# Altium project Mirny.PrjPCB (part 4 of 4)

## Sheet Supply_Mirny.SchDoc: Power supply
size 420 x 297 mm; Author: K.B.; CompanyName: WUT; DrawnBy: K.B.; Organization: WUT ISE; Address1: Warsaw Univeristy of Technology; Address2: Nowowiejska 15/19; DocumentNumber: 6; Revision: 1.1.4; SheetNumber: 6; SheetTotal: 8; EDA_Number: ARTIQ; Projet: ARTIQ/SINARA; ModifiedBy: -; CreateDate: XX/XX/XXXX; CheckedDate: -; Title2: DC/DC & LDOs; DivGrp: ISE; Designer: K.B.; ModifiedDate: -; ProjectName: ARTIQ/SINARA
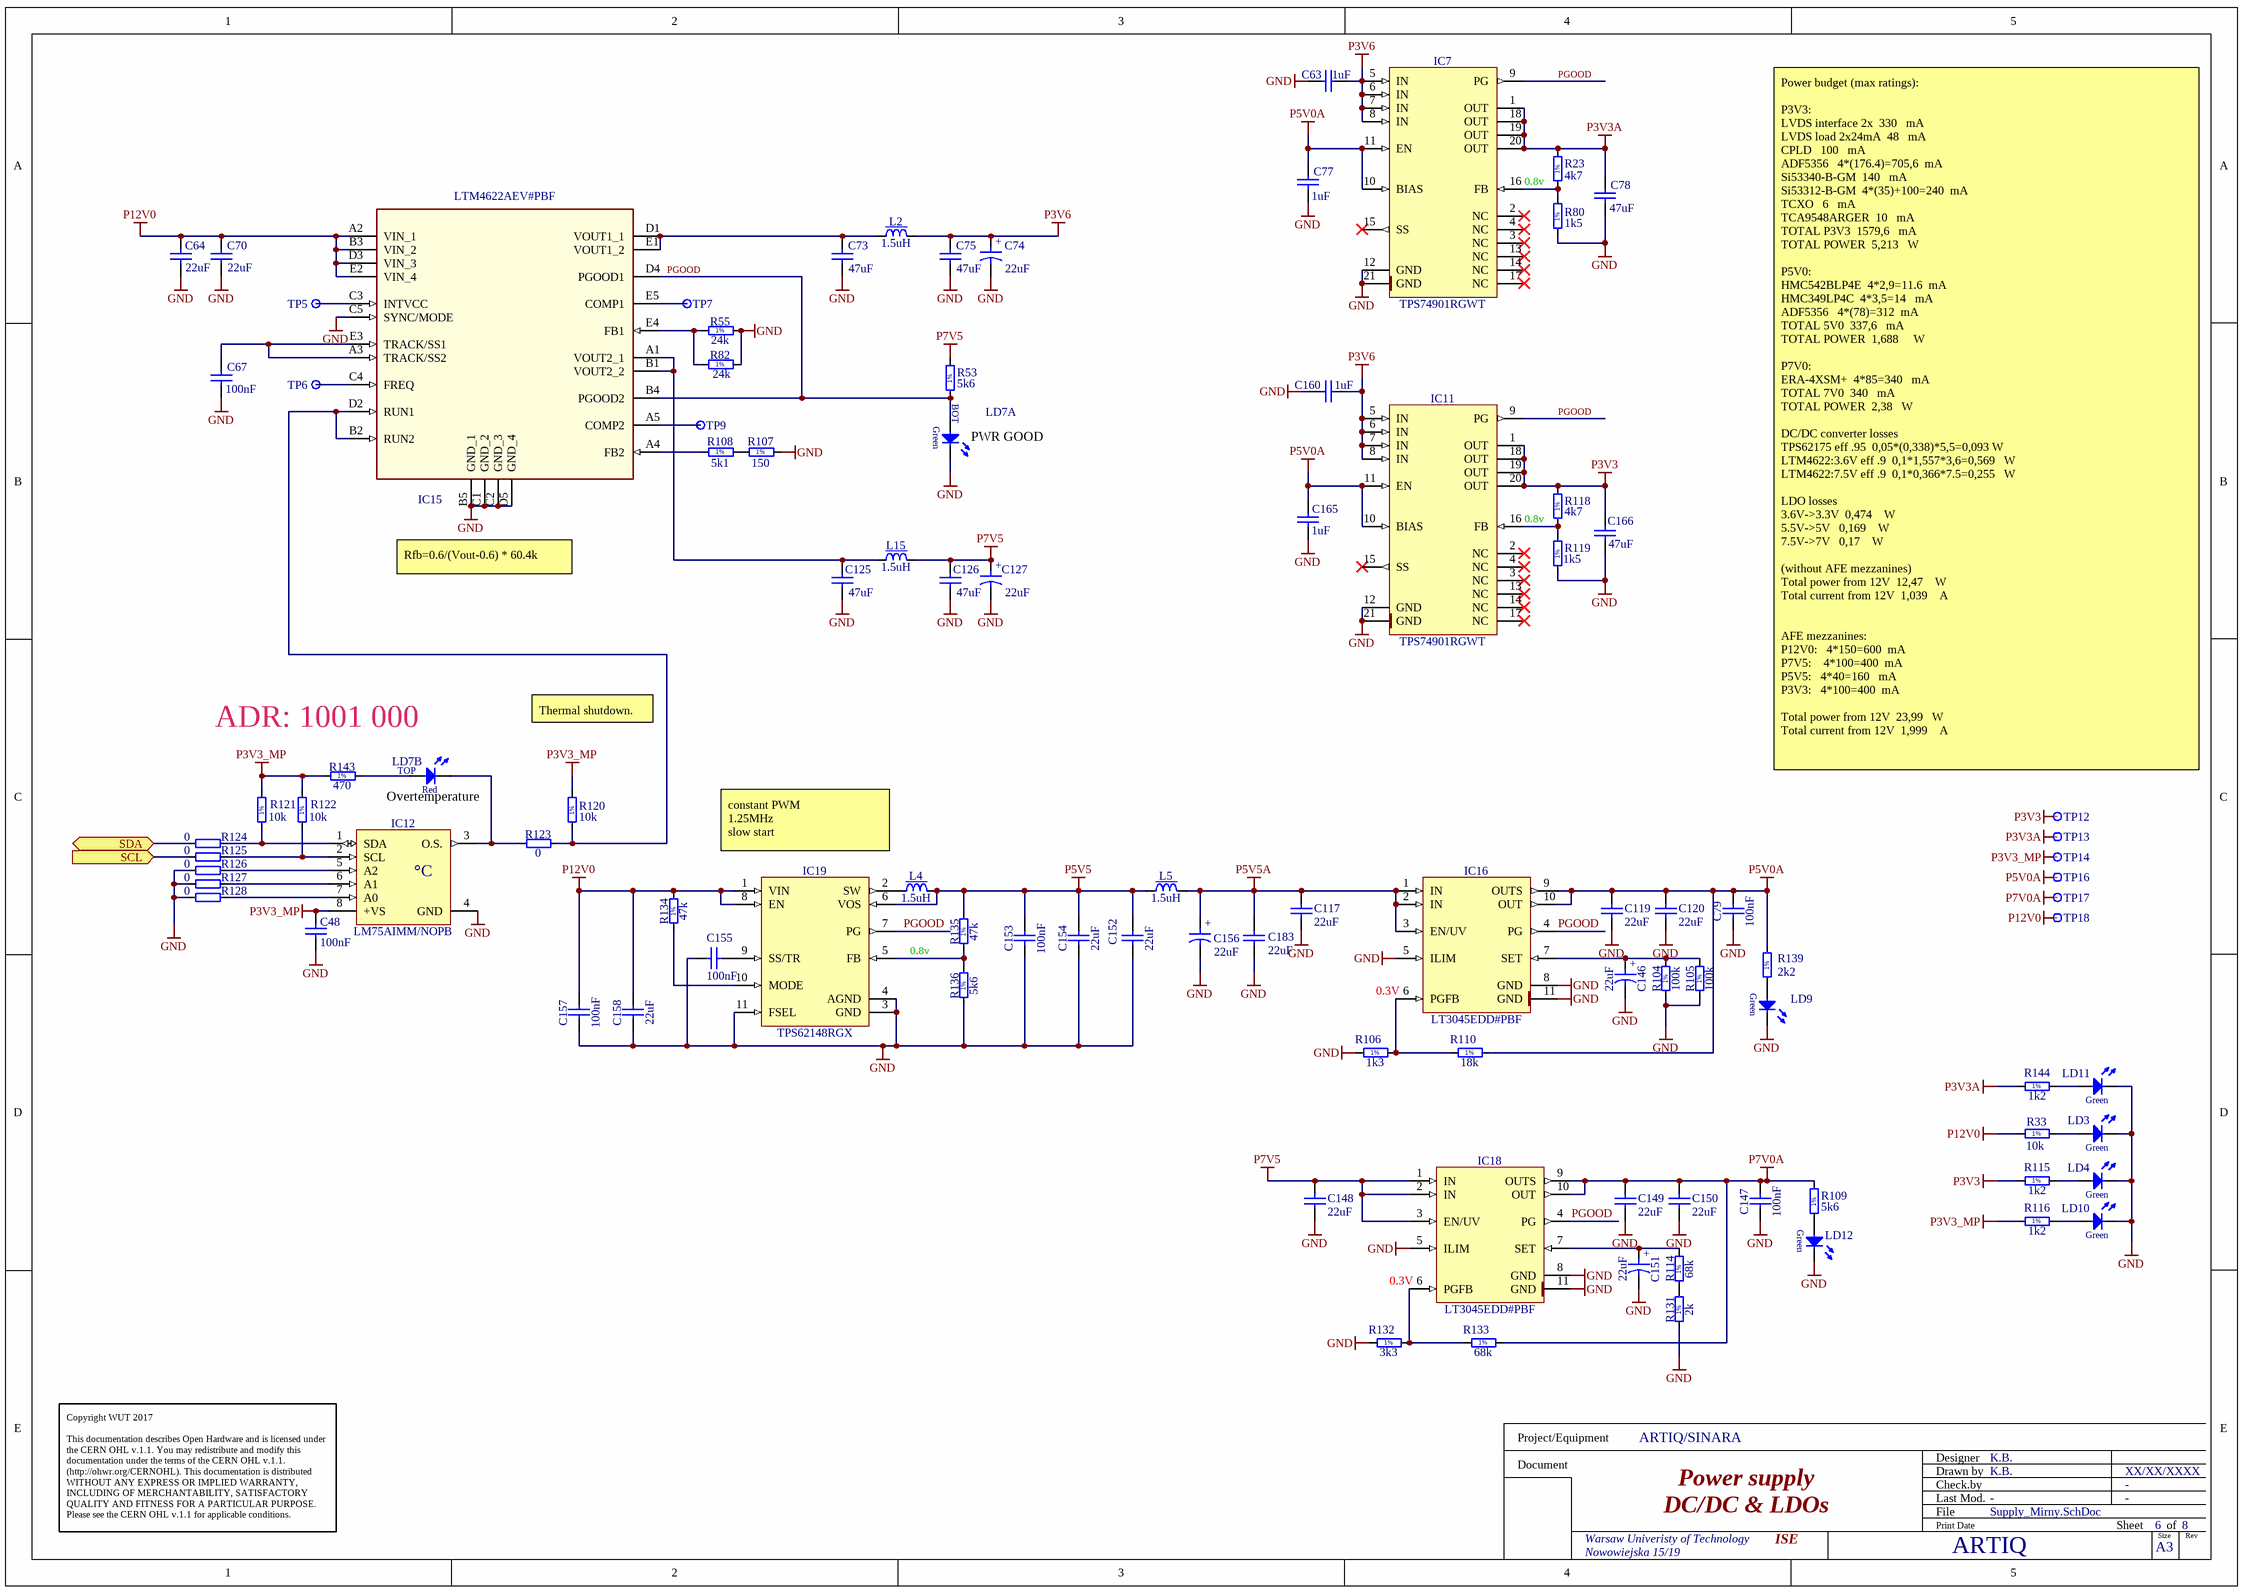
[diagram p8: Supply_Mirny.SchDoc]

### Parts
(Parts that share a designator on the sheet are numbered #1, #2 ... from top to bottom, then left to right.)
C48#2  100nF  [CAPC1005X55N]
C63  1uF  [CAPC1005X55N]
C64  22uF  [CAPC2012X135N]
C67  100nF  [CAPC1005X55N]
C70  22uF  [CAPC2012X135N]
C73  47uF  [CAPC3225X270N]
C74  22uF  [CAPMP3528X210N]
C75  47uF  [CAPC3225X270N]
C77  1uF  [CAPC1005X55N]
C78  47uF  [CAPC3225X270N]
C79  100nF  [CAPC1005X55N]
C117  22uF  [CAPC2012X135N]
C119  22uF  [CAPC2012X135N]
C120  22uF  [CAPC2012X135N]
C125  47uF  [CAPC3225X270N]
C126  47uF  [CAPC3225X270N]
C127  22uF  [CAPMP3528X210N]
C146  22uF  [CAPMP3528X210N]
C147  100nF  [CAPC1005X55N]
C148  22uF  [CAPC2012X135N]
C149  22uF  [CAPC2012X135N]
C150  22uF  [CAPC2012X135N]
C151  22uF  [CAPMP3528X210N]
C152  22uF  [CAPC2012X135N]
C153  100nF  [CAPC1005X55N]
C154  22uF  [CAPC2012X135N]
C155  100nF  [CAPC1005X55N]
C156  22uF  [CAPMP3528X210N]
C157  100nF  [CAPC1005X55N]
C158  22uF  [CAPC2012X135N]
C160  1uF  [CAPC1005X55N]
C165  1uF  [CAPC1005X55N]
C166  47uF  [CAPC3225X270N]
C183  22uF  [CAPC2012X135N]
IC7  TPS74901RGWT  [QFN65P500X500X100-21N-S325]
IC11  TPS74901RGWT  [QFN65P500X500X100-21N-S325]
IC12  LM75AIMM/NOPB  [SOP65P490X109-8N]
IC15  LTM4622AEV#PBF  [LGA25C127P5X5_625X625X190]
IC16  LT3045EDD#PBF  [SON50P300X300X80-11N-R175X248]
IC18  LT3045EDD#PBF  [SON50P300X300X80-11N-R175X248]
IC19  TPS62148RGX  [TEXAS_RGX0011A]
L2  1.5uH  [IND_TDK_SPM6530]
L4  1.5uH  [IND_TDK_SPM6530]
L5  1.5uH  [IND_TDK_SPM6530]
L15  1.5uH  [IND_TDK_SPM6530]
LD3  Green  [LED_KINGBRIGHT_KPH-1608CGCKr]  (value not drawn)
LD4  Green  [LED_KINGBRIGHT_KPH-1608CGCKr]  (value not drawn)
LD7  Red/Green  [LED_DIALIGHT_571-0112F]  (value not drawn)  (parts A,B of 2)
LD9  Green  [LED_KINGBRIGHT_KPH-1608CGCKr]  (value not drawn)
LD10  Green  [LED_KINGBRIGHT_KPH-1608CGCKr]  (value not drawn)
LD11  Green  [LED_KINGBRIGHT_KPH-1608CGCKr]  (value not drawn)
LD12  Green  [LED_KINGBRIGHT_KPH-1608CGCKr]  (value not drawn)
R23  4k7  [RESC1608X55N]
R33  10k  [RESC1005X40N]
R53  5k6  [RESC1608X55N]
R55  24k  [RESC1608X55N]
R80  1k5  [RESC1608X55N]
R82  24k  [RESC1608X55N]
R104  100k  [RESC1005X40N]
R105  100k  [RESC1005X40N]
R106  1k3  [RESC1608X55N]
R107  150  [RESC1005X40N]
R108  5k1  [RESC1608X55N]
R109  5k6  [RESC1608X55N]
R110  18k  [RESC1005X40N]
R114  68k  [RESC1005X40N]
R115  1k2  [RESC1005X40N]
R116  1k2  [RESC1005X40N]
R118  4k7  [RESC1608X55N]
R119  1k5  [RESC1608X55N]
R120  10k  [RESC1005X40N]
R121  10k  [RESC1005X40N]
R122  10k  [RESC1005X40N]
R123  0  [RESC1005X40N]
R124  0  [RESC1005X40N]
R125  0  [RESC1005X40N]
R126  0  [RESC1005X40N]
R127  0  [RESC1005X40N]
R128  0  [RESC1005X40N]
R131  2k  [RESC1005X40N]
R132  3k3  [RESC1608X55N]
R133  68k  [RESC1005X40N]
R134  47k  [RESC1005X40N]
R135  47k  [RESC1005X40N]
R136  5k6  [RESC1005X40N]
R139  2k2  [RESC1608X55N]
R143  470  [RESC1005X40N]
R144  1k2  [RESC1005X40N]
TP5  Test Point  [TPS127]  (value not drawn)
TP6  Test Point  [TPS127]  (value not drawn)
TP7  Test Point  [TPS127]  (value not drawn)
TP9  Test Point  [TPS127]  (value not drawn)
TP12  Test Point  [TPS127]  (value not drawn)  (no BOM)
TP13  Test Point  [TPS127]  (value not drawn)  (no BOM)
TP14  Test Point  [TPS127]  (value not drawn)  (no BOM)
TP16  Test Point  [TPS127]  (value not drawn)  (no BOM)
TP17  Test Point  [TPS127]  (value not drawn)  (no BOM)
TP18  Test Point  [TPS127]  (value not drawn)  (no BOM)

### Ports
SCL (in), SDA (bidir)

### Nets
GND: C48#2.1 C63.2 C64.1 C67.1 C70.1 C73.1 C74.2 C75.1 C77.1 C78.1 C79.1 C117.2 C119.2 C120.2 C125.1 C126.1 C127.2 C146.2 C147.1 C148.2 C149.2 C150.2 C151.2 C152.1 C153.1 C154.1 C155.2 C156.2 C157.1 C158.1 C160.2 C165.1 C166.1 C183.1 IC7.12(GND) IC7.21(GND) IC11.12(GND) IC11.21(GND) IC12.4(GND) IC15.B5(GND_1) IC15.C1(GND_2) IC15.C2(GND_3) IC15.C5(SYNC/MODE) IC15.D5(GND_4) IC16.5(ILIM) IC16.8(GND) IC16.11(GND) IC18.5(ILIM) IC18.8(GND) IC18.11(GND) IC19.3(GND) IC19.4(AGND) IC19.11(FSEL) LD3.1(C) LD4.1(C) LD7.1(C) LD9.1(C) LD10.1(C) LD11.1(C) LD12.1(C) R55.2 R80.1 R82.2 R104.1 R105.1 R106.1 R107.2 R119.1 R126.1 R127.1 R128.1 R131.1 R132.1 R136.1
P3V3: C166.2 IC11.1(OUT) IC11.18(OUT) IC11.19(OUT) IC11.20(OUT) R115.1 R118.2 TP12.1
P3V3_MP: C48#2.2 IC12.8(+VS) R116.1 R120.2 R121.2 R122.2 R143.1 TP14.1
P3V3A: C78.2 IC7.1(OUT) IC7.18(OUT) IC7.19(OUT) IC7.20(OUT) R23.2 R144.1 TP13.1
P3V6: C63.1 C74.1 C75.2 C160.1 IC7.5(IN) IC7.6(IN) IC7.7(IN) IC7.8(IN) IC11.5(IN) IC11.6(IN) IC11.7(IN) IC11.8(IN) L2.2
P5V0A: C77.2 C79.2 C119.1 C120.1 C165.2 IC7.10(BIAS) IC7.11(EN) IC11.10(BIAS) IC11.11(EN) IC16.9(OUTS) IC16.10(OUT) R110.2 R139.2 TP16.1
P5V5: C152.2 C153.2 C154.2 IC19.6(VOS) L4.2 L5.1 R135.2
P5V5A: C117.1 C156.1 C183.2 IC16.1(IN) IC16.2(IN) IC16.3(EN/UV) L5.2
P7V0A: C147.2 C149.1 C150.1 IC18.9(OUTS) IC18.10(OUT) R109.2 R133.2 TP17.1
P7V5: C126.2 C127.1 C148.1 IC18.1(IN) IC18.2(IN) IC18.3(EN/UV) L15.2 R53.2
P12V0: C64.2 C70.2 C157.2 C158.2 IC15.A2(VIN_1) IC15.B3(VIN_2) IC15.D3(VIN_3) IC15.E2(VIN_4) IC19.1(VIN) IC19.8(EN) R33.1 R134.2 TP18.1
PGOOD: IC7.9(PG) IC11.9(PG) IC15.B4(PGOOD2) IC15.D4(PGOOD1) IC16.4(PG) IC18.4(PG) IC19.7(PG) LD7.2(A) R53.1
NetC67_2: C67.2 IC15.A3(TRACK/SS2) IC15.E3(TRACK/SS1)
NetC73_2: C73.2 IC15.D1(VOUT1_1) IC15.E1(VOUT1_2) L2.1
NetC125_2: C125.2 IC15.A1(VOUT2_1) IC15.B1(VOUT2_2) L15.1
NetC146_1: C146.1 IC16.7(SET) R104.2 R105.2
NetC151_1: C151.1 IC18.7(SET) R114.2
NetC155_1: C155.1 IC19.9(SS/TR)
NetIC7_16: IC7.16(FB) R23.1 R80.2
NetIC11_16: IC11.16(FB) R118.1 R119.2
NetIC12_1: IC12.1(SDA) R121.1 R124.2
NetIC12_2: IC12.2(SCL) R122.1 R125.2
NetIC12_3: IC12.3(O.S.) LD7.3(C) R123.1
NetIC12_5: IC12.5(A2) R126.2
NetIC12_6: IC12.6(A1) R127.2
NetIC12_7: IC12.7(A0) R128.2
NetIC15_A4: IC15.A4(FB2) R108.1
NetIC15_A5: IC15.A5(COMP2) TP9.1
NetIC15_B2: IC15.B2(RUN2) IC15.D2(RUN1) R120.1 R123.2
NetIC15_C3: IC15.C3(INTVCC) TP5.1
NetIC15_C4: IC15.C4(FREQ) TP6.1
NetIC15_E4: IC15.E4(FB1) R55.1 R82.1
NetIC15_E5: IC15.E5(COMP1) TP7.1
NetIC16_6: IC16.6(PGFB) R106.2 R110.1
NetIC18_6: IC18.6(PGFB) R132.2 R133.1
NetIC19_2: IC19.2(SW) L4.1
NetIC19_5: IC19.5(FB) R135.1 R136.2
NetIC19_10: IC19.10(MODE) R134.1
NetLD3_2: LD3.2(A) R33.2
NetLD4_2: LD4.2(A) R115.2
NetLD7_4: LD7.4(A) R143.2
NetLD9_2: LD9.2(A) R139.1
NetLD10_2: LD10.2(A) R116.2
NetLD11_2: LD11.2(A) R144.2
NetLD12_2: LD12.2(A) R109.1
NetR107_1: R107.1 R108.2
NetR114_1: R114.1 R131.2
NetR124_1: R124.1 ; port SDA
NetR125_1: R125.1 ; port SCL

Not connected (* = marked no-connect by the designer): IC7 2(NC)* 3(NC)* 4(NC)* 13(NC)* 14(NC)* 15(SS)* 17(NC)*; IC11 2(NC)* 3(NC)* 4(NC)* 13(NC)* 14(NC)* 15(SS)* 17(NC)*

### Notes on the sheet
- 0.8v
- (near LD7) PWR GOOD
- Rfb=0.6/(Vout-0.6) * 60.4k
- ADR: 1001 000
- Thermal shutdown.
- (near LD7) Overtemperature
- Power budget (max ratings):
  P3V3:
  LVDS interface 2x		330			mA
  LVDS load 2x24mA		48			mA
  CPLD			100			mA
  ADF5356			4*(176.4)=705,6		mA
  Si53340-B-GM		140			mA
  Si53312-B-GM		4*(35)+100=240		mA
  TCXO			6			mA
  TCA9548ARGER		10			mA
  TOTAL P3V3		1579,6			mA
  TOTAL POWER		5,213			W
  P5V0:
  HMC542BLP4E		4*2,9=11.6		mA
  HMC349LP4C		4*3,5=14			mA
  ADF5356			4*(78)=312		mA
  TOTAL 5V0		337,6			mA
  TOTAL POWER		1,688 	 		W
  P7V0:
  ERA-4XSM+		4*85=340			mA
  TOTAL 7V0		340			mA
  TOTAL POWER		2,38			W
  DC/DC converter losses
  TPS62175 eff .95		0,05*(0,338)*5,5=0,093	W
  LTM4622:3.6V eff .9		0,1*1,557*3,6=0,569 		W
  LTM4622:7.5V eff .9		0,1*0,366*7.5=0,255 		W
  LDO losses
  3.6V->3.3V		0,474 			W
  5.5V->5V			0,169 			W
  7.5V->7V			0,17 			W
  (without AFE mezzanines)
  Total power from 12V 	12,47 			W
  Total current from 12V 	1,039			 A
  AFE mezzanines:
  P12V0:			4*150=600		mA
  P7V5: 			4*100=400		mA
  P5V5:			4*40=160			mA
  P3V3:			4*100=400		mA
  Total power from 12V 	23,99			W
  Total current from 12V 	1,999 			A
- constant PWM
  1.25MHz
  slow start
- (near IC16) 0.3V
- (near IC18) 0.3V
- Copyright WUT 2017
  This documentation describes Open Hardware and is licensed under the CERN OHL v.1.1. You may redistribute and modify this documentation under the terms of the CERN OHL v.1.1. (http://ohwr.org/CERNOHL). This documentation is distributed WITHOUT ANY EXPRESS OR IMPLIED WARRANTY, INCLUDING OF MERCHANTABILITY, SATISFACTORY QUALITY AND FITNESS FOR A PARTICULAR PURPOSE. Please see the CERN OHL v.1.1 for applicable conditions.
- Project/Equipment
- Document
- Designer
- Drawn by
- Check.by
- File
- Last Mod.
- Print Date
- Sheet
- Size
- A3
- of
- Rev
- (in symbol CTE3528-21_22UF_10V_10%_LESR0700) +
- (in symbol LED_DIALIGHT_571-0112F, part A) BOT; Green
- (in symbol LED_DIALIGHT_571-0112F, part B) TOP; Red
- (in symbol LM75AIMM/NOPB) °C
- (in symbol R0402_2K_1%_0.0625W_100PPM) 1%
- (in symbol R0402_5K6_1%_0.0625W_100PPM) 1%
- (in symbol R0402_10K_1%_0.0625W_100PPM) 1%
- (in symbol R0402_18K_1%_0.0625W_100PPM) 1%
- (in symbol R0402_47K_1%_0.0625W_100PPM) 1%
- (in symbol R0402_49R9_1%_0.0625W_100PPM) 1%
- (in symbol R0402_68K_1%_0.0625W_100PPM) 1%
- (in symbol R0402_100K_1%_0.0625W_100PPM) 1%
- (in symbol R0402_150R_1%_0.0625W_100PPM) 1%
- (in symbol R0402_470R_1%_0.0625W_100PPM) 1%
- (in symbol R0603_1K3_1%_0.1W_100PPM) 1%
- (in symbol R0603_1K5_1%_0.1W_100PPM) 1%
- (in symbol R0603_2K2_1%_0.1W_100PPM) 1%
- (in symbol R0603_3K3_1%_0.1W_100PPM) 1%
- (in symbol R0603_4K7_1%_0.1W_100PPM) 1%
- (in symbol R0603_5k1_1%_0.1W_100PPM) 1%
- (in symbol R0603_5K6_1%_0.1W_100PPM) 1%
- (in symbol R0603_24K_1%_0.1W_100PPM) 1%

### Library data of the parts
C48#2 C67 C79 C147 C153 C155 C157 = CC0402_100NF_16V_10%_X5R: Non-polarised capacitor; Part Description: SMD Multilayer Chip Ceramic Capacitor; Manufacturer: GENERIC; Manufacturer1 Part Number: GRM155R61C104KA88D; Voltage: 16V; TC: X5R; Tolerance: ±10%; Part Number: CC0402_100NF_16V_10%_X5R; Component Kind: Standard; Component Type: Standard; Pin Count: 2; Value: 100nF; Status: None; Manufacturer Part Number: CC0402_100NF_16V_10%_X5R; Case: 0402; Mounted: Yes; Socket: No; SMD: Yes; Sense: No; Manufacturer1 Example: MURATA; Manufacturer1 ComponentHeight: 0.55mm; HelpURL: \\cern.ch\dfs\Applications\Altium\Datasheets\CC0402_X5R_MURATA_GRM.pdf; Author: CERN DEM JLC; CreateDate: 10.12.2013; LatestRevisionDate: 10.12.2013
C63 C77 C160 C165 = CC0402_1UF_16V_10%_X5R: Non-polarised capacitor; Part Description: SMD Multilayer Chip Ceramic Capacitor; Manufacturer: GENERIC; Manufacturer1 Part Number: C1005X5R1C105KT; Voltage: 16V; TC: X5R; Tolerance: ±10%; Part Number: CC0402_1UF_16V_10%_X5R; Component Kind: Standard; Component Type: Standard; Pin Count: 2; Value: 1uF; Status: Preferred; Manufacturer Part Number: CC0402_1UF_16V_10%_X5R; Case: 0402; Mounted: Yes; Socket: No; SMD: Yes; Sense: No; Manufacturer1 Example: TDK; Manufacturer1 ComponentHeight: 0.55mm; HelpURL: \\cern.ch\dfs\Applications\Altium\Datasheets\CC0402_X5R_TDK_C.pdf; Author: CERN DEM JLC; CreateDate: 2012-10-25; LatestRevisionDate: 2012-10-25
C64 C70 C117 C119 C120 C148-C150 C152 C154 C158 C183 = CC0805_22UF_16V_10%_X5R: Non-polarised capacitor; Part Description: SMD Multilayer Chip Ceramic Capacitor; Manufacturer: GENERIC; Manufacturer1 Part Number: C2012X5R1C226KT; Voltage: 16V; TC: X5R; Tolerance: ±10%; Part Number: CC0805_22UF_16V_10%_X5R; Component Kind: Standard; Component Type: Standard; Pin Count: 2; Value: 22uF; Status: Preferred; Manufacturer Part Number: CC0805_22UF_16V_10%_X5R; Case: 0805; Mounted: Yes; Socket: No; SMD: Yes; Sense: No; Manufacturer1 Example: TDK; Manufacturer1 ComponentHeight: 1.35mm; HelpURL: \\cern.ch\dfs\Applications\Altium\Datasheets\CC0805_X5R_TDK_C.pdf; Author: CERN DEM JLC; CreateDate: 25.10.2012; LatestRevisionDate: 25.10.2012
C73 C75 C78 C125 C126 C166 = CC1210_47UF_10V_20%_X5R: Non-polarised capacitor; Part Description: SMD Multilayer Chip Ceramic Capacitor; Manufacturer: GENERIC; Manufacturer1 Part Number: LMK325BJ476MM-T; Voltage: 10V; TC: X5R; Tolerance: ±20%; Part Number: CC1210_47UF_10V_20%_X5R; Component Kind: Standard; Component Type: Standard; Pin Count: 2; Value: 47uF; Status: None; Manufacturer Part Number: CC1210_47UF_10V_20%_X5R; Case: 1210; Mounted: Yes; Socket: No; SMD: Yes; Sense: No; Manufacturer1 Example: TAIYO YUDEN; Manufacturer1 ComponentHeight: 2.7mm; HelpURL: \\cern.ch\dfs\Applications\Altium\Datasheets\CC1210_X5R_TAIYO-YUDEN_HIGH-VALUE.pdf; Author: CERN DEM JLC; CreateDate: 04.05.2011; LatestRevisionDate: 04.05.2011
C74 C127 C146 C151 C156 = CTE3528-21_22UF_10V_10%_LESR0700: Polarised capacitor; Part Description: Low ESR 0R7 Solid Tantalum Chip Capacitor; Manufacturer: GENERIC; Manufacturer1 Part Number: TPSB226K010R0700; Voltage: 10V; Tolerance: ±10%; Part Number: CTE3528-21_22UF_10V_10%_LESR0700; Component Kind: Standard; Component Type: Standard; Pin Count: 2; Value: 22uF; Status: Preferred; Manufacturer Part Number: CTE3528-21_22UF_10V_10%_LESR0700; Case: B; Mounted: Yes; Socket: No; SMD: Yes; Sense: No; Manufacturer1 Example: AVX; Manufacturer1 ComponentHeight: 2.1mm; HelpURL: \\cern.ch\dfs\Applications\Altium\Datasheets\CTE-LESR_AVX_TPS.pdf; Author: CERN DEM JLC; CreateDate: 05.05.2008; LatestRevisionDate: 20.01.2009
IC7 IC11 = TPS74901RGWT: 3A, 0.8 to 3.6V Adjustable Low-Dropout Linear Regulator with Programmable Soft-Start; Part Description: 0.8V to 3.6V, 3.0A Low Dropout Linear Regulator with Programmable Soft-Start; Manufacturer: TEXAS INSTRUMENTS; PressFit: No; Bonding: No; Part Number: TPS74901RGWT; Component Kind: Standard; Component Type: Standard; Device: TPS74901RGWT; PackageDescription: QFN, 0.65mm pitch,square; 20 pin, 5mm X 5mm X 1mm H body (w/thermal tab 3.25 X 3.25mm),  IPC Medium Density; Manufacturer Part Number: TPS74901RGWT; Pin Count: 21; Case: QFN20; Mounted: Yes; Socket: No; SMD: Yes; Sense: No; ComponentHeight: 1mm; HelpURL: \\cern.ch\dfs\Applications\Altium\Datasheets\TPS74901RGWT.pdf; Author: CERN DEM JLC; CreateDate: 07.03.2013; LatestRevisionDate: 07.03.2013
IC12 = LM75AIMM/NOPB: Digital Temperature Sensor and Thermal Watchdog with Two-Wire Interface; Part Description: -25° to +100°C ±2°C Digital Temperature Sensor and Thermal Watchdog with Two-Wire Interface; Manufacturer: TEXAS INSTRUMENTS; PressFit: No; Bonding: No; Part Number: LM75AIMM/NOPB; Component Kind: Standard; Component Type: Standard; Device: LM75AIMM/NOPB; PackageDescription: SOP, 0.65mm pitch; 8 pin,3.00mm W X 3.00mm L X 1.09mm H bodyI, PC Medium Density; Manufacturer Part Number: LM75AIMM/NOPB; Pin Count: 8; Case: SSOP8; Mounted: Yes; Socket: No; SMD: Yes; Sense: No; ComponentHeight: 1.09mm; HelpURL: \\cern.ch\dfs\Applications\Altium\Datasheets\LM75AIMM-NOPB.pdf; Author: CERN DEM JLC; CreateDate: 15.10.2012; LatestRevisionDate: 15.10.2012
IC15 = PM_LTM4622: Dual Ultrathin 2A or Single 4A, 3.6V to 20V, 1.5V to 12V   Step-Down DC/DC μModule Regulator; Manufacturer: LINEAR TECHNOLOGY; PressFit: No; Bonding: No; Part Number: LTM4622AEV#PBF; Component Kind: Standard; Component Type: Standard; Device: LTM4622AEV#PBF; PackageDescription: LGA, 25-Leads, Body 6.25x6.25mmx1.90mm, Pitch 1.27mm; Part Description: Dual Ultrathin 2A or Single 4A, 3.6V to 20V, 1.5V to 12V   Step-Down DC/DC μModule Regulator; Manufacturer Part Number: LTM4622AEV#PBF; Pin Count: 25; Case: LGA25; Mounted: Yes; Socket: No; SMD: Yes; Sense: No; ComponentHeight: 2.92mm; HelpURL: \\cern.ch\dfs\Applications\Altium\Datasheets\LTM4619EV#PBF.pdf; Author: GK; CreateDate: 06.05.2010; LatestRevisionDate: 07.12.2011
IC16 IC18 = LT3045EDD#PBF: 20V, 500mA, Ultralow Noise, Ultrahigh PSRR Linear Regulator; Manufacturer: LINEAR TECHNOLOGY; PressFit: No; Bonding: No; Part Number: LT3045EDD#PBF; Component Kind: Standard; Component Type: Standard; Device: LT3045EDD#PBF; PackageDescription: SON, 0.50mm Pitch, 10-pin, 3.00mm W  X 3.00mm L X 0.80mm Height, (w/thermal tab 1.75 X 2.48 mm), IPC Medium Density; Part Description: 20V, 500mA, Ultralow Noise, Ultrahigh PSRR Linear Regulator; Manufacturer Part Number: LT3045EDD#PBF; Pin Count: 11; Case: SON10; Mounted: Yes; Socket: No; SMD: Yes; Sense: No; ComponentHeight: 0.8mm; HelpURL: \\cern.ch\dfs\Applications\Altium\Datasheets\LT3045EDD#PBF.pdf; Author: CERN DEM JLC; CreateDate: 07.12.2016; LatestRevisionDate: 07.12.2016
IC19 = TPS62148RGX: 3V-17V 2A Step-Down Converter, High Accuracy, With DCS-Control; Manufacturer: TEXAS INSTRUMENTS; PressFit: No; Bonding: No; Part Number: TPS62148RGX; Component Kind: Standard; Component Type: Standard; Device: TPS62148RGX; PackageDescription: TEXAS Case Style (R-VQFN-HR-N11), 0.50mm Pitch, 11-pin, 2.00mm W X 3.00mm L X 1.00mm H Body; Part Description: 3V-17V 2A Step-Down Converter, High Accuracy, With DCS-Control; Manufacturer Part Number: TPS62148RGX; Pin Count: 11; Case: QFN14; Mounted: Yes; Socket: No; SMD: Yes; Sense: No; ComponentHeight: 1mm; HelpURL: \\cern.ch\dfs\Applications\Altium\Datasheets\TPS62148RGX.pdf; Author: CERN DEM MR; CreateDate: 08.02.2019; LatestRevisionDate: 08.02.2019
L2 L4 L5 L15 = IND_1.5UH_20%_TDK_SPM6530: Inductor With Core; Part Description: SMD Inductor for Power Circuits (Wound Metal), SPM Series; Manufacturer: TDK; Manufacturer Part Number: SPM6530T-1R5M100; Power: 11A; Resistance: 0.0097R; Tolerance: ±20%; Part Number: IND_1.5UH_20%_TDK_SPM6530; Component Kind: Standard; Component Type: Standard; Pin Count: 2; Value: 1.5uH; Status: None; Mounted: Yes; Socket: No; SMD: Yes; Sense: No; ComponentHeight: 3mm; HelpURL: \\cern.ch\dfs\Applications\Altium\Datasheets\IND_TDK_SPM6530.pdf; Author: CERN DEM MR; CreateDate: 08.11.2016; LatestRevisionDate: 08.11.2016
LD3 LD4 LD9-LD12 = LED_0603_Green: Green 0603; Part Number: LED_KINGBRIGHT_KPH-1608CGCK; Part Description: SMD Green LED, Case 1.6mmX0.8mm(0603), 0.65mm Thickness; Manufacturer: KINGBRIGHT; Manufacturer Part Number: KPH-1608CGCK; PressFit: No; Bonding: No; Component Kind: Standard; Component Type: Standard; Color: Green; Footprint: LED_KINGBRIGHT_KPH-1608CGCK; PackageDescription: SMT Green LED, Case 0603, Body L 1.6 x W 0.8mm H 0.65mm; Pin Count: 2; Mounted: Yes; Socket: No; SMD: Yes; Sense: No; ComponentHeight: 0.65mm; HelpURL: \\cern.ch\dfs\Applications\Altium\Datasheets\LED_KINGBRIGHT_KPH-1608CGCK.pdf; Author: CERN DEM JLC; CreateDate: 03.07.2017; LatestRevisionDate: 03.07.2017
LD7 = LED_DIALIGHT_571-0112F: 2x LED  Botom Green, Top Red; Part Description: Dual 2mm  LEDs, Red Top,Green Bot, CBI® Circuit Board Indicator (Without positioning pins); PressFit: No; Bonding: No; Part Number: LED_DIALIGHT_571-0112F; Component Kind: Standard; Component Type: Standard; Color: Red/Green; PackageDescription: 2x 2mm LED (Top: Red, Bot: Green) PCB Edge Mounting (Without positioning pins) DIALIGHT 571 Serie; Manufacturer: DIALIGHT; Manufacturer Part Number: 571-0112F; Pin Count: 4; Mounted: Yes; Socket: No; SMD: No; Sense: No; ComponentHeight: 8.6mm; HelpURL: \\cern.ch\dfs\Applications\Altium\Datasheets\LED_DIALIGHT_571-0112F.pdf; Author: CERN DEM JLC; CreateDate: 09.11.2009; LatestRevisionDate: 17.03.2010
R23 R118 = R0603_4K7_1%_0.1W_100PPM: Resistor - 1%; Part Description: General Purpose Thick Film Chip Resistor; Manufacturer: GENERIC; Manufacturer1 Part Number: NRC06F4701TRF; Power: 0.1W; TC: ±100ppm/°C; PressFit: No; Part Number: R0603_4K7_1%_0.1W_100PPM; Component Kind: Standard; Component Type: Standard; Pin Count: 2; Value: 4k7; Status: Preferred; Tolerance: ±1%; Manufacturer Part Number: R0603_4K7_1%_0.1W_100PPM; Case: 0603; Mounted: Yes; Sense: No; Socket: No; SMD: Yes; Manufacturer1 Example: NIC COMPONENT; Manufacturer1 ComponentHeight: 0.55mm; HelpURL: \\cern.ch\dfs\Applications\Altium\Datasheets\R0603_NIC_NRC.pdf; Author: CERN DEM JLC; CreateDate: 03.12.2007; LatestRevisionDate: 13.03.2008
R33 = R0402_10K_1%_0.0625W_100PPM: Resistor - 1%; Part Description: General Purpose Thick Film Chip Resistor; Manufacturer: GENERIC; Manufacturer1 Part Number: 232270671003L; TC: ±100ppm/°C; Part Number: R0402_10K_1%_0.0625W_100PPM; Component Kind: Standard; Component Type: Standard; Pin Count: 2; Value: 10k; Status: Not recommended; Power: 0.0625W; Tolerance: ±1%; Manufacturer Part Number: R0402_10K_1%_0.0625W_100PPM; Case: 0402; Mounted: Yes; Sense: No; Socket: No; SMD: Yes; Manufacturer1 Example: YAGEO PHYCOMP; Manufacturer1 ComponentHeight: 0.4mm; HelpURL: \\cern.ch\dfs\Applications\Altium\Datasheets\R0402_Phycomp_RC0402.pdf; Author: CERN DEM JLC; CreateDate: 03.12.2007; LatestRevisionDate: 17.10.2012
R53 R109 = R0603_5K6_1%_0.1W_100PPM: Resistor - 1%; Part Description: General Purpose Thick Film Chip Resistor; Manufacturer: GENERIC; Manufacturer1 Part Number: NRC06F5601TRF; Power: 0.1W; TC: ±100ppm/°C; Part Number: R0603_5K6_1%_0.1W_100PPM; Component Kind: Standard; Component Type: Standard; Pin Count: 2; Value: 5k6; Status: Preferred; Tolerance: ±1%; Manufacturer Part Number: R0603_5K6_1%_0.1W_100PPM; Case: 0603; Mounted: Yes; Sense: No; Socket: No; SMD: Yes; Manufacturer1 Example: NIC COMPONENT; Manufacturer1 ComponentHeight: 0.55mm; HelpURL: \\cern.ch\dfs\Applications\Altium\Datasheets\R0603_NIC_NRC.pdf; Author: CERN DEM JLC; CreateDate: 03.12.2007; LatestRevisionDate: 13.03.2008
R55 R82 = R0603_24K_1%_0.1W_100PPM: Resistor - 1%; Part Description: General Purpose Thick Film Chip Resistor; Manufacturer: GENERIC; Manufacturer1 Part Number: NRC06F2402TRF; Power: 0.1W; TC: ±100ppm/°C; PressFit: No; Part Number: R0603_24K_1%_0.1W_100PPM; Component Kind: Standard; Component Type: Standard; Pin Count: 2; Value: 24k; Status: Preferred; Tolerance: ±1%; Manufacturer Part Number: R0603_24K_1%_0.1W_100PPM; Case: 0603; Mounted: Yes; Sense: No; Socket: No; SMD: Yes; Manufacturer1 Example: NIC COMPONENT; Manufacturer1 ComponentHeight: 0.55mm; HelpURL: \\cern.ch\dfs\Applications\Altium\Datasheets\R0603_NIC_NRC.pdf; Author: CERN DEM JLC; CreateDate: 03.12.2007; LatestRevisionDate: 13.03.2008
R80 R119 = R0603_1K5_1%_0.1W_100PPM: Resistor - 1%; Part Description: General Purpose Thick Film Chip Resistor; Manufacturer: GENERIC; Manufacturer1 Part Number: NRC06F1501TRF; Power: 0.1W; TC: ±100ppm/°C; PressFit: No; Part Number: R0603_1K5_1%_0.1W_100PPM; Component Kind: Standard; Component Type: Standard; Pin Count: 2; Value: 1k5; Status: Preferred; Tolerance: ±1%; Manufacturer Part Number: R0603_1K5_1%_0.1W_100PPM; Case: 0603; Mounted: Yes; Sense: No; Socket: No; SMD: Yes; Manufacturer1 Example: NIC COMPONENT; Manufacturer1 ComponentHeight: 0.55mm; HelpURL: \\cern.ch\dfs\Applications\Altium\Datasheets\R0603_NIC_NRC.pdf; Author: CERN DEM JLC; CreateDate: 03.12.2007; LatestRevisionDate: 13.03.2008
R104 R105 = R0402_100K_1%_0.0625W_100PPM: Resistor - 1%; Part Description: General Purpose Thick Film Chip Resistor; Manufacturer: GENERIC; Manufacturer1 Part Number: 232270671004L; TC: ±100ppm/°C; PressFit: No; Part Number: R0402_100K_1%_0.0625W_100PPM; Component Kind: Standard; Component Type: Standard; Pin Count: 2; Value: 100k; Status: Not Recommended; Power: 0.0625W; Tolerance: ±1%; Manufacturer Part Number: R0402_100K_1%_0.0625W_100PPM; Case: 0402; Mounted: Yes; Sense: No; Socket: No; SMD: Yes; Manufacturer1 Example: YAGEO PHYCOMP; Manufacturer1 ComponentHeight: 0.4mm; HelpURL: \\cern.ch\dfs\Applications\Altium\Datasheets\R0402_Phycomp_RC0402.pdf; Author: CERN DEM JLC; CreateDate: 03.12.2007; LatestRevisionDate: 17.10.2012
R106 = R0603_1K3_1%_0.1W_100PPM: Resistor - 1%; Part Description: General Purpose Thick Film Chip Resistor; Manufacturer: GENERIC; Manufacturer1 Part Number: NRC06F1301TRF; Power: 0.1W; TC: ±100ppm/°C; PressFit: No; Part Number: R0603_1K3_1%_0.1W_100PPM; Component Kind: Standard; Component Type: Standard; Pin Count: 2; Value: 1k3; Status: Preferred; Tolerance: ±1%; Manufacturer Part Number: R0603_1K3_1%_0.1W_100PPM; Case: 0603; Mounted: Yes; Sense: No; Socket: No; SMD: Yes; Manufacturer1 Example: NIC COMPONENT; Manufacturer1 ComponentHeight: 0.55mm; HelpURL: \\cern.ch\dfs\Applications\Altium\Datasheets\R0603_NIC_NRC.pdf; Author: CERN DEM JLC; CreateDate: 03.12.2007; LatestRevisionDate: 13.03.2008
R107 = R0402_150R_1%_0.0625W_100PPM: Resistor - 1%; Part Description: General Purpose Thick Film Chip Resistor; Manufacturer: GENERIC; Manufacturer1 Part Number: 232270671501L; TC: ±100ppm/°C; PressFit: No; Part Number: R0402_150R_1%_0.0625W_100PPM; Component Kind: Standard; Component Type: Standard; Pin Count: 2; Value: 150; Status: Not Recommended; Power: 0.0625W; Tolerance: ±1%; Manufacturer Part Number: R0402_150R_1%_0.0625W_100PPM; Case: 0402; Mounted: Yes; Sense: No; Socket: No; SMD: Yes; Manufacturer1 Example: YAGEO PHYCOMP; Manufacturer1 ComponentHeight: 0.4mm; HelpURL: \\cern.ch\dfs\Applications\Altium\Datasheets\R0402_Phycomp_RC0402.pdf; Author: CERN DEM JLC; CreateDate: 03.12.2007; LatestRevisionDate: 17.10.2012
R108 = R0603_5k1_1%_0.1W_100PPM: Resistor - 1%; Part Description: General Purpose Thick Film Chip Resistor; Manufacturer: GENERIC; Manufacturer1 Part Number: NRC06F5101TRF; Power: 0.1W; TC: ±100ppm/°C; PressFit: No; Part Number: R0603_5K1_1%_0.1W_100PPM; Component Kind: Standard; Component Type: Standard; Pin Count: 2; Value: 5k1; Status: Preferred; Tolerance: ±1%; Manufacturer Part Number: R0603_5K1_1%_0.1W_100PPM; Case: 0603; Mounted: Yes; Sense: No; Socket: No; SMD: Yes; Manufacturer1 Example: NIC COMPONENT; Manufacturer1 ComponentHeight: 0.55mm; HelpURL: \\cern.ch\dfs\Applications\Altium\Datasheets\R0603_NIC_NRC.pdf; Author: CERN DEM JLC; CreateDate: 03.12.2007; LatestRevisionDate: 13.03.2008
R110 = R0402_18K_1%_0.0625W_100PPM: Resistor - 1%; Part Description: General Purpose Thick Film Chip Resistor; Manufacturer: GENERIC; Manufacturer1 Part Number: 232270671803L; TC: ±100ppm/°C; PressFit: No; Part Number: R0402_18K_1%_0.0625W_100PPM; Component Kind: Standard; Component Type: Standard; Pin Count: 2; Value: 18k; Status: Not Recommended; Power: 0.0625W; Tolerance: ±1%; Manufacturer Part Number: R0402_18K_1%_0.0625W_100PPM; Case: 0402; Mounted: Yes; Sense: No; Socket: No; SMD: Yes; Manufacturer1 Example: YAGEO PHYCOMP; Manufacturer1 ComponentHeight: 0.4mm; HelpURL: \\cern.ch\dfs\Applications\Altium\Datasheets\R0402_Phycomp_RC0402.pdf; Author: CERN DEM JLC; CreateDate: 03.12.2007; LatestRevisionDate: 17.10.2012
R114 R133 = R0402_68K_1%_0.0625W_100PPM: Resistor - 1%; Part Description: General Purpose Thick Film Chip Resistor; Manufacturer: GENERIC; Manufacturer1 Part Number: 232270676803L; TC: ±100ppm/°C; PressFit: No; Part Number: R0402_68K_1%_0.0625W_100PPM; Component Kind: Standard; Component Type: Standard; Pin Count: 2; Value: 68k; Status: Not Recommended; Power: 0.0625W; Tolerance: ±1%; Manufacturer Part Number: R0402_68K_1%_0.0625W_100PPM; Case: 0402; Mounted: Yes; Sense: No; Socket: No; SMD: Yes; Manufacturer1 Example: YAGEO PHYCOMP; Manufacturer1 ComponentHeight: 0.4mm; HelpURL: \\cern.ch\dfs\Applications\Altium\Datasheets\R0402_Phycomp_RC0402.pdf; Author: CERN DEM JLC; CreateDate: 03.12.2007; LatestRevisionDate: 17.10.2012
R115 R116 R144 = R0402_49R9_1%_0.0625W_100PPM: Resistor - 1%; Part Number: R0402_1K2_1%_0.0625W_100PPM; Part Description: General Purpose Thick Film Chip Resistor; Manufacturer: GENERIC; Manufacturer1 Part Number: NRC04F1201TRF; TC: ±100ppm/°C; PressFit: No; Component Kind: Standard; Component Type: Standard; Pin Count: 2; Value: 1k2; Status: Preferred; Power: 0.0625W; Tolerance: ±1%; Manufacturer Part Number: R0402_1K2_1%_0.0625W_100PPM; Case: 0402; Mounted: Yes; Sense: No; Socket: No; SMD: Yes; Manufacturer1 Example: NIC COMPONENT; Manufacturer1 ComponentHeight: 0.4mm; HelpURL: \\cern.ch\dfs\Applications\Altium\Datasheets\R0402_Phycomp_RC0402.pdf; Author: CERN DEM JLC; CreateDate: 24.10.2012; LatestRevisionDate: 24.10.2012
R120-R122 = R0402_10K_1%_0.0625W_100PPM: Resistor - 1%; Part Description: General Purpose Thick Film Chip Resistor; Manufacturer: GENERIC; Manufacturer1 Part Number: 232270671003L; TC: ±100ppm/°C; PressFit: No; Part Number: R0402_10K_1%_0.0625W_100PPM; Component Kind: Standard; Component Type: Standard; Pin Count: 2; Value: 10k; Status: Not Recommended; Power: 0.0625W; Tolerance: ±1%; Manufacturer Part Number: R0402_10K_1%_0.0625W_100PPM; Case: 0402; Mounted: Yes; Sense: No; Socket: No; SMD: Yes; Manufacturer1 Example: YAGEO PHYCOMP; Manufacturer1 ComponentHeight: 0.4mm; HelpURL: \\cern.ch\dfs\Applications\Altium\Datasheets\R0402_Phycomp_RC0402.pdf; Author: CERN DEM JLC; CreateDate: 03.12.2007; LatestRevisionDate: 17.10.2012
R123-R128 = R0402_0R_JUMPER: Resistor; Part Description: 1A (0.05R Max DC Resistance) Zero Ohm Jumper; Manufacturer: GENERIC; Manufacturer1 Part Number: 232270591001L; Part Number: R0402_0R_JUMPER; Component Kind: Standard; Component Type: Standard; Pin Count: 2; Value: 0; Status: Not recommended; Manufacturer Part Number: R0402_0R_JUMPER; Case: 0402; Mounted: Yes; Sense: No; Socket: No; SMD: Yes; Manufacturer1 Example: YAGEO PHYCOMP; Manufacturer1 ComponentHeight: 0.4mm; HelpURL: \\cern.ch\dfs\Applications\Altium\Datasheets\R0402_Phycomp_RC0402.pdf; Author: CERN DEM JLC; CreateDate: 03.12.2007; LatestRevisionDate: 17.10.2012
R131 = R0402_2K_1%_0.0625W_100PPM: Resistor - 1%; Part Description: General Purpose Thick Film Chip Resistor; Manufacturer: GENERIC; Manufacturer1 Part Number: 232270672002L; TC: ±100ppm/°C; PressFit: No; Part Number: R0402_2K_1%_0.0625W_100PPM; Component Kind: Standard; Component Type: Standard; Pin Count: 2; Value: 2k; Status: Not Recommended; Power: 0.0625W; Tolerance: ±1%; Manufacturer Part Number: R0402_2K_1%_0.0625W_100PPM; Case: 0402; Mounted: Yes; Sense: No; Socket: No; SMD: Yes; Manufacturer1 Example: YAGEO PHYCOMP; Manufacturer1 ComponentHeight: 0.4mm; HelpURL: \\cern.ch\dfs\Applications\Altium\Datasheets\R0402_Phycomp_RC0402.pdf; Author: CERN DEM JLC; CreateDate: 03.12.2007; LatestRevisionDate: 17.10.2012
R132 = R0603_3K3_1%_0.1W_100PPM: Resistor - 1%; Part Description: General Purpose Thick Film Chip Resistor; Manufacturer: GENERIC; Manufacturer1 Part Number: NRC06F3301TRF; Power: 0.1W; TC: ±100ppm/°C; PressFit: No; Part Number: R0603_3K3_1%_0.1W_100PPM; Component Kind: Standard; Component Type: Standard; Pin Count: 2; Value: 3k3; Status: Preferred; Tolerance: ±1%; Manufacturer Part Number: R0603_3K3_1%_0.1W_100PPM; Case: 0603; Mounted: Yes; Sense: No; Socket: No; SMD: Yes; Manufacturer1 Example: NIC COMPONENT; Manufacturer1 ComponentHeight: 0.55mm; HelpURL: \\cern.ch\dfs\Applications\Altium\Datasheets\R0603_NIC_NRC.pdf; Author: CERN DEM JLC; CreateDate: 03.12.2007; LatestRevisionDate: 13.03.2008
R134 R135 = R0402_47K_1%_0.0625W_100PPM: Resistor - 1%; Part Description: General Purpose Thick Film Chip Resistor; Manufacturer: GENERIC; Manufacturer1 Part Number: RC0402FR-0747KL; TC: ±100ppm/°C; PressFit: No; Part Number: R0402_47K_1%_0.0625W_100PPM; Component Kind: Standard; Component Type: Standard; Pin Count: 2; Value: 47k; Status: Not Recommended; Power: 0.0625W; Tolerance: ±1%; Manufacturer Part Number: R0402_47K_1%_0.0625W_100PPM; Case: 0402; Mounted: Yes; Sense: No; Socket: No; SMD: Yes; Manufacturer1 Example: YAGEO PHYCOMP; Manufacturer1 ComponentHeight: 0.4mm; HelpURL: \\cern.ch\dfs\Applications\Altium\Datasheets\R0402_Phycomp_RC0402.pdf; Author: CERN DEM JLC; CreateDate: 03.12.2007; LatestRevisionDate: 17.10.2012
R136 = R0402_5K6_1%_0.0625W_100PPM: Resistor - 1%; Part Description: General Purpose Thick Film Chip Resistor; Manufacturer: GENERIC; Manufacturer1 Part Number: 232270675602L; TC: ±100ppm/°C; PressFit: No; Part Number: R0402_5K6_1%_0.0625W_100PPM; Component Kind: Standard; Component Type: Standard; Pin Count: 2; Value: 5k6; Status: Not Recommended; Power: 0.0625W; Tolerance: ±1%; Manufacturer Part Number: R0402_5K6_1%_0.0625W_100PPM; Case: 0402; Mounted: Yes; Sense: No; Socket: No; SMD: Yes; Manufacturer1 Example: YAGEO PHYCOMP; Manufacturer1 ComponentHeight: 0.4mm; HelpURL: \\cern.ch\dfs\Applications\Altium\Datasheets\R0402_Phycomp_RC0402.pdf; Author: CERN DEM JLC; CreateDate: 03.12.2007; LatestRevisionDate: 17.10.2012
R139 = R0603_2K2_1%_0.1W_100PPM: Resistor - 1%; Part Description: General Purpose Thick Film Chip Resistor; Manufacturer: GENERIC; Manufacturer1 Part Number: NRC06F2201TRF; Power: 0.1W; TC: ±100ppm/°C; Part Number: R0603_2K2_1%_0.1W_100PPM; Component Kind: Standard; Component Type: Standard; Pin Count: 2; Value: 2k2; Status: Preferred; Tolerance: ±1%; Manufacturer Part Number: R0603_2K2_1%_0.1W_100PPM; Case: 0603; Mounted: Yes; Sense: No; Socket: No; SMD: Yes; Manufacturer1 Example: NIC COMPONENT; Manufacturer1 ComponentHeight: 0.55mm; HelpURL: \\cern.ch\dfs\Applications\Altium\Datasheets\R0603_NIC_NRC.pdf; Author: CERN DEM JLC; CreateDate: 03.12.2007; LatestRevisionDate: 13.03.2008
R143 = R0402_470R_1%_0.0625W_100PPM: Resistor - 1%; Part Description: General Purpose Thick Film Chip Resistor; Manufacturer: GENERIC; Manufacturer1 Part Number: 232270674701L; TC: ±100ppm/°C; PressFit: No; Part Number: R0402_470R_1%_0.0625W_100PPM; Component Kind: Standard; Component Type: Standard; Pin Count: 2; Value: 470; Status: Not Recommended; Power: 0.0625W; Tolerance: ±1%; Manufacturer Part Number: R0402_470R_1%_0.0625W_100PPM; Case: 0402; Mounted: Yes; Sense: No; Socket: No; SMD: Yes; Manufacturer1 Example: YAGEO PHYCOMP; Manufacturer1 ComponentHeight: 0.4mm; HelpURL: \\cern.ch\dfs\Applications\Altium\Datasheets\R0402_Phycomp_RC0402.pdf; Author: CERN DEM JLC; CreateDate: 03.12.2007; LatestRevisionDate: 17.10.2012
TP5-TP7 TP9 TP12-TP14 TP16-TP18 = SMD_PAD_1.27X1.27MM: Part Description: 1.27mm x 1.27mm PCB Copper Area (SMD Test Point); Mounted: No; Part Number: SMD_PAD_1.27X1.27MM; Component Type: Standard (No BOM); Pin Count: 1; Family: Test Point; Socket: No; SMD: Yes; Sense: No; Status: None; ComponentHeight: 0mm; HelpURL: Undefined; Author: CERN DEM JLC; CreateDate: 12.01.2008; LatestRevisionDate: 12.01.2008; PackageDescription: 1.27mm x 1.27mm PCB Copper Area (SMD Test Point)
  TP5-TP7 TP9: Component Kind: Standard (No BOM)

## Nets that join several sheets
GND: CTRL_LOGIC (39 pins), Mirny (81 pins), U_VCO_channel0 (44 pins), U_VCO_OUT_channel0 (56 pins), U_VCO_OUT_channel1 (56 pins), U_VCO_OUT_channel2 (56 pins), U_VCO_OUT_channel3 (56 pins), U_VCO_channel1 (44 pins), U_VCO_channel2 (44 pins), U_VCO_channel3 (44 pins), CLK_INPUT (33 pins), B2B_connectors (20 pins), LVDS_IFC_VCO (41 pins), Supply_Mirny (74 pins)
P3V3: CTRL_LOGIC (28 pins), B2B_connectors (C106.2 L10.2), LVDS_IFC_VCO (26 pins), Supply_Mirny (8 pins)
P3V3_MP: LVDS_IFC_VCO (5 pins), Supply_Mirny (8 pins)
P3V3A: U_VCO_channel0 (L6A.2 L11A.1 L18A.2), U_VCO_channel1 (L6B.2 L11B.1 L18B.2), U_VCO_channel2 (L6C.2 L11C.1 L18C.2), U_VCO_channel3 (L6D.2 L11D.1 L18D.2), CLK_INPUT (L3.2 L13.2 T1.2), Supply_Mirny (8 pins)
P5V0A: U_VCO_channel0 (L20A.2), U_VCO_OUT_channel0 (L8A.2 L9A.1), U_VCO_OUT_channel1 (L8B.2 L9B.1), U_VCO_OUT_channel2 (L8C.2 L9C.1), U_VCO_OUT_channel3 (L8D.2 L9D.1), U_VCO_channel1 (L20B.2), U_VCO_channel2 (L20C.2), U_VCO_channel3 (L20D.2), Supply_Mirny (14 pins)
P5V5A: B2B_connectors (C111.2 L12.1), Supply_Mirny (7 pins)
P7V0A: U_VCO_OUT_channel0 (C42A.2 C43A.2 R46A.1), U_VCO_OUT_channel1 (C42B.2 C43B.2 R46B.1), U_VCO_OUT_channel2 (C42C.2 C43C.2 R46C.1), U_VCO_OUT_channel3 (C42D.2 C43D.2 R46D.1), Supply_Mirny (8 pins)
P7V5: B2B_connectors (C123.2 L14.1), Supply_Mirny (8 pins)
P12V0: B2B_connectors (C134.2 L21.2), LVDS_IFC_VCO (J1.28 J1.29), Supply_Mirny (13 pins)
NetC196_1: Mirny (J2.1), CLK_INPUT (C196.1)
NetIC3A_19: Mirny (R50.2), U_VCO_OUT_channel0 (IC3A.19)
NetIC3B_19: Mirny (R101.2), U_VCO_OUT_channel1 (IC3B.19)
NetIC3C_19: Mirny (R102.2), U_VCO_OUT_channel2 (IC3C.19)
NetIC3D_19: Mirny (R147.2), U_VCO_OUT_channel3 (IC3D.19)
RF_OUT0: Mirny (J3.1), U_VCO_OUT_channel0 (C62A.2)
RF_OUT1: Mirny (J4.1), U_VCO_OUT_channel1 (C62B.2)
RF_OUT2: Mirny (J5.1), U_VCO_OUT_channel2 (C62C.2)
RF_OUT3: Mirny (J6.1), U_VCO_OUT_channel3 (C62D.2)
SG0: Mirny (9 pins), CLK_INPUT (R81.1 TR3.6)
VCO_CLK0_N: U_VCO_channel0 (C27A.1 R4A.2), CLK_INPUT (R146.1 R168.2)
VCO_CLK0_P: U_VCO_channel0 (C13A.1 R4A.1), CLK_INPUT (R148.1 R166.2)
VCO_CLK1_N: U_VCO_channel1 (C27B.1 R4B.2), CLK_INPUT (R149.1 R164.2)
VCO_CLK1_P: U_VCO_channel1 (C13B.1 R4B.1), CLK_INPUT (R150.1 R162.2)
VCO_CLK2_N: U_VCO_channel2 (C27C.1 R4C.2), CLK_INPUT (R151.1 R160.2)
VCO_CLK2_P: U_VCO_channel2 (C13C.1 R4C.1), CLK_INPUT (R152.1 R158.2)
VCO_CLK3_N: U_VCO_channel3 (C27D.1 R4D.2), CLK_INPUT (C137.1)
VCO_CLK3_P: U_VCO_channel3 (C13D.1 R4D.1), CLK_INPUT (C136.1)
VCO_OUT_N: U_VCO_channel0 (C14A.2), U_VCO_OUT_channel0 (C50A.1 TR1A.4)
VCO_OUT_N: U_VCO_OUT_channel1 (C50B.1 TR1B.4), U_VCO_channel1 (C14B.2)
VCO_OUT_N: U_VCO_OUT_channel2 (C50C.1 TR1C.4), U_VCO_channel2 (C14C.2)
VCO_OUT_N: U_VCO_OUT_channel3 (C50D.1 TR1D.4), U_VCO_channel3 (C14D.2)
VCO_OUT_P: U_VCO_channel0 (C15A.2), U_VCO_OUT_channel0 (C45A.2 TR1A.6)
VCO_OUT_P: U_VCO_OUT_channel1 (C45B.2 TR1B.6), U_VCO_channel1 (C15B.2)
VCO_OUT_P: U_VCO_OUT_channel2 (C45C.2 TR1C.6), U_VCO_channel2 (C15C.2)
VCO_OUT_P: U_VCO_OUT_channel3 (C45D.2 TR1D.6), U_VCO_channel3 (C15D.2)
VCO_OUTM: U_VCO_channel0 (C85A.2), B2B_connectors (J9.1)
VCO_OUTM: U_VCO_channel1 (C85B.2), B2B_connectors (J11.1)
VCO_OUTM: U_VCO_channel2 (C85C.2), B2B_connectors (J12.1)
VCO_OUTM: U_VCO_channel3 (C85D.2), B2B_connectors (J13.1)

## Assembly variants
ADF4355: not fitted C1A C1B C1C C1D C12A C12B C12C C12D C44A C44B C44C C44D C46A C46B C46C C46D C80 C86A C86B C86C C86D C108 C109 C113 C114 C115 C116 C122 C144 C145 CLIP1 CLIP2 CLIP3 CLIP4 CLIP5 CLIP6 CLIP7 CLIP8 CLIP9 CLIP10 CLIP11 CLIP12 CLIP13 CLIP14 CLIP15 CLIP16 CLIP17 CLIP18 CLIP19 CLIP20 CLIP21 CLIP22 CLIP23 CLIP24 CLIP25 CLIP26 CLIP27 CLIP28 CLIP29 CLIP30 FL1A FL1B FL1C FL1D J15 L16A L16B L16C L16D L17A L17B L17C L17D OSC1 R19A R19B R19C R19D R20A R20B R20C R20D R22A R22B R22C R22D R31A R31B R31C R31D R32A R32B R32C R32D R39A R39B R39C R39D R40A R40B R40C R40D R41A R41B R41C R41D R42A R42B R42C R42D R45A R45B R45C R45D R52A R52B R52C R52D R54A R54B R54C R54D R61 R68A R68B R68C R68D R70 R73 R76 R77 R78 R79 R81 R87 R91 R98 R103A R103B R103C R103D R112 R113 R146 R148 R149 R150 R151 R152 R157 R159 R161 R163 R165 R167
ADF4356: not fitted C1A C1B C1C C1D C12A C12B C12C C12D C44A C44B C44C C44D C46A C46B C46C C46D C80 C86A C86B C86C C86D C108 C109 C113 C114 C115 C116 C122 C144 C145 CLIP1 CLIP2 CLIP3 CLIP4 CLIP5 CLIP6 CLIP7 CLIP8 CLIP9 CLIP10 CLIP11 CLIP12 CLIP13 CLIP14 CLIP15 CLIP16 CLIP17 CLIP18 CLIP19 CLIP20 CLIP21 CLIP22 CLIP23 CLIP24 CLIP25 CLIP26 CLIP27 CLIP28 CLIP29 CLIP30 FL1A FL1B FL1C FL1D J15 L16A L16B L16C L16D L17A L17B L17C L17D OSC1 R19A R19B R19C R19D R20A R20B R20C R20D R22A R22B R22C R22D R31A R31B R31C R31D R32A R32B R32C R32D R39A R39B R39C R39D R40A R40B R40C R40D R41A R41B R41C R41D R42A R42B R42C R42D R45A R45B R45C R45D R52A R52B R52C R52D R54A R54B R54C R54D R61 R68A R68B R68C R68D R70 R73 R76 R77 R78 R79 R81 R84 R87 R91 R98 R103A R103B R103C R103D R112 R113 R146 R148 R149 R150 R151 R152 R157 R159 R161 R163 R165 R167
ADF5355: not fitted C1A C1B C1C C1D C12A C12B C12C C12D C44A C44B C44C C44D C46A C46B C46C C46D C80 C86A C86B C86C C86D C108 C109 C113 C114 C115 C116 C122 C144 C145 CLIP1 CLIP2 CLIP3 CLIP4 CLIP5 CLIP6 CLIP7 CLIP8 CLIP9 CLIP10 CLIP11 CLIP12 CLIP13 CLIP14 CLIP15 CLIP16 CLIP17 CLIP18 CLIP19 CLIP20 CLIP21 CLIP22 CLIP23 CLIP24 CLIP25 CLIP26 CLIP27 CLIP28 CLIP29 CLIP30 FL1A FL1B FL1C FL1D J15 L16A L16B L16C L16D L17A L17B L17C L17D OSC1 R19A R19B R19C R19D R20A R20B R20C R20D R22A R22B R22C R22D R31A R31B R31C R31D R32A R32B R32C R32D R39A R39B R39C R39D R40A R40B R40C R40D R41A R41B R41C R41D R42A R42B R42C R42D R45A R45B R45C R45D R52A R52B R52C R52D R54A R54B R54C R54D R61 R68A R68B R68C R68D R70 R73 R76 R77 R78 R79 R81 R84 R87 R91 R98 R103A R103B R103C R103D R112 R113 R146 R148 R149 R150 R151 R152 R157 R159 R161 R163 R165 R167
ADF5356: not fitted C1A C1B C1C C1D C12A C12B C12C C12D C44A C44B C44C C44D C46A C46B C46C C46D C80 C86A C86B C86C C86D C108 C109 C113 C114 C115 C116 C122 C144 C145 CLIP1 CLIP2 CLIP3 CLIP4 CLIP5 CLIP6 CLIP7 CLIP8 CLIP9 CLIP10 CLIP11 CLIP12 CLIP13 CLIP14 CLIP15 CLIP16 CLIP17 CLIP18 CLIP19 CLIP20 CLIP21 CLIP22 CLIP23 CLIP24 CLIP25 CLIP26 CLIP27 CLIP28 CLIP29 CLIP30 FL1A FL1B FL1C FL1D J15 L16A L16B L16C L16D L17A L17B L17C L17D OSC1 R19A R19B R19C R19D R20A R20B R20C R20D R22A R22B R22C R22D R31A R31B R31C R31D R32A R32B R32C R32D R39A R39B R39C R39D R40A R40B R40C R40D R41A R41B R41C R41D R42A R42B R42C R42D R45A R45B R45C R45D R52A R52B R52C R52D R54A R54B R54C R54D R61 R68A R68B R68C R68D R70 R73 R76 R77 R78 R79 R81 R84 R87 R91 R98 R103A R103B R103C R103D R112 R113 R146 R148 R149 R150 R151 R152 R157 R159 R161 R163 R165 R167